# Altium schematic sheet Current Sensors.SchDoc
size A
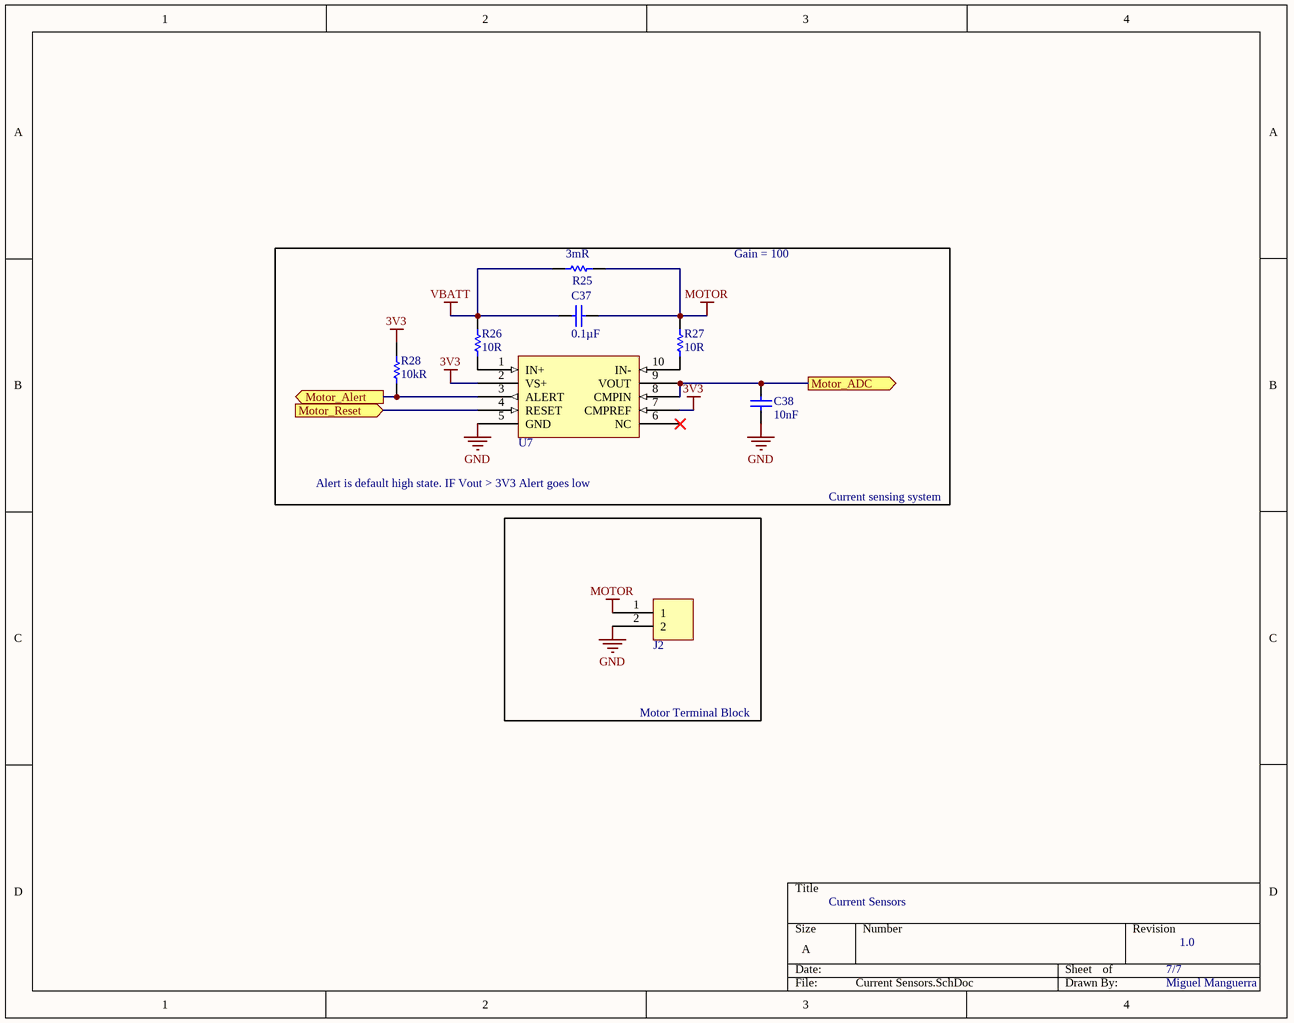
[diagram p0: Current Sensors.SchDoc]

## Parts
C37  Capacitance: 0.1µF  [CAPC1608N(0603")]  (hidden comment: 0.1uF, 50V, 10%, X7R, 0603)
C38  value 10nF  [CAPC1608N(0603")]  (hidden comment: 10 nF, 50V 0603 SMD, Ceramic)
J2  2x1 Terminal Block 3.5mm  [2x1 Terminal Block 3.5mm-Footprint-1]  (value not drawn)
R25  3mR, 1%, 1W, 1206  [RESC1632X07M]  (value not drawn)
R26  Resistance: 10R  [FP-ERJ3EK-IPC_A]  (hidden comment: ERJ3EKF10R0V)
R27  Resistance: 10R  [FP-ERJ3EK-IPC_A]  (hidden comment: ERJ3EKF10R0V)
R28  Resistance: 10kR  [RESC1608X55X25ML10T15]  (hidden comment: RC0603FR-0710KL)
U7  INA381A3IDGSR  [TSSOP50P490X110-10N]  (value not drawn)

## Blocks framed on the sheet
Motor Terminal Block: J2

## Ports
Motor_ADC (out), Motor_Alert (out), Motor_Reset (in)

## Nets
3V3: R28.2 U7.2(VS+) U7.7(CMPREF)
GND: C38.1(Anode) J2.2 U7.5(GND)
MOTOR: C37.1(Anode) J2.1 R25.2 R27.2
VBATT: C37.2(Cathode) R25.1 R26.2
Motor_ADC: C38.2(Cathode) U7.8(CMPIN) U7.9(VOUT) ; port Motor_ADC
Motor_Alert: R28.1 U7.3(ALERT) ; port Motor_Alert
Motor_Reset: U7.4(RESET) ; port Motor_Reset
NetR26_1: R26.1 U7.1(IN+)
NetR27_1: R27.1 U7.10(IN-)

Not connected (* = marked no-connect by the designer): U7 6(NC)*

## Notes on the sheet
- Gain = 100
- Alert is default high state. IF Vout > 3V3 Alert goes low
- Current sensing system
- Current Sensors
- 7/7
- 1.0
- Miguel Manguerra

## Library data of the parts
C37 = CMP-006-0007-1: 0.1µF ±10% Ceramic Capacitor X7R 0603 (1608 Metric); Operating Temperature: -55°C ~ 125°C; Pin Count: 2; Design Item ID: 0.1uF, 50V, 10%, X7R, 0603; Package / Case: 0603 (1608 Metric); Source: AUVic_Schematic_Library_Capacitors.SchLib; ComponentLink1URL: https://www.digikey.ca/product-detail/en/tdk-corporation/C1608X7R1H104M080AA/445-5098-1-ND/2093713; ComponentLink1Description: Digi-Key; Mounting Type: Surface Mount, MLCC; Component Type: Standard; Created By: Poorna Chander Kalidas
C38 = CMP-006-0010-1: Capacitor, Ceramic, 50V, +/- 10%, 0603 SMD; MFG: Samsung; MFG#: GRM188R61A475KE15D; Created By: Gabriel; Design Item ID: 10 nF, 50V 0603 SMD, Ceramic; PackageDescription: Chip Capacitor; Source: AUVic_Schematic_Library_Capacitors.SchLib; Published: 16-06-23; Pin Count: 2; Publisher: AUVic; Component Type: Standard
J2 = CMP-00117-2: P=3.5mm Screw terminal RoHS; Created by: Miguel Manguerra; LCSC Part #: C474892
R25 = CMP-00122-4: 3 mOhms ±1% 1W Chip Resistor Wide 1206 (3216 Metric), 0612; Resistance: 3mR
R26 R27 = CMP-00034-2: PANASONIC - ERJ3EKF10R0V - SMD Chip Resistor, 0603 [1608 Metric], 10 ohm, ERJ3EK Series, 75 V, Thick Film, 100 mW; Temperature Coefficient: 100ppm/°C; Tolerance: 1%; Max Power Dissipation: 100mW; Voltage Rating (DC): 75V; Package Quantity: 5000; Case Code (Imperial): 0603; Military Standard: Not; Depth: 0.8mm; Number of Terminations: 2; Working Voltage: 75V; Min Operating Temperature: -55°C; Width: 0.8mm; Composition: Thick Film; Packaging: Tape and Reel; Power Rating: 100mW; REACH SVHC: No SVHC; Max Operating Temperature: 155°C; Case Code (Metric): 1608; Features: Automotive AEC-Q200; Case/Package: 0603; Length: 1.6mm; Number of Pins: 2; Lead Free: Lead Free; Height: 0.45mm; Voltage Rating: 75V; Contact Plating: Tin; Termination: SMD/SMT; Mount: Surface Mount; Radiation Hardening: No
R28 = CMP-00037-1: Res General Purpose Thick Film 0603 10K Ohm 1% 1/10W ±100ppm/°C Molded SMD Paper T/R; Power Rating: 100mW; Voltage Rating (DC): 50V; Voltage Rating: 75V; Case/Package: 0603; Weight: 7.1E-05oz; Case Code (Imperial): 0603; Composition: Thick Film; Depth: 0.8mm; Min Operating Temperature: -55°C; Width: 0.8mm; Height: 0.45mm; Military Standard: Not; Packaging: Tape and Reel; Termination: SMD/SMT; Lead Free: Lead Free; Temperature Coefficient: 100ppm/°C; Number of Pins: 2; Max Operating Temperature: 155°C; Lead Pitch: 0.3mm; REACH SVHC: No SVHC; Case Code (Metric): 1608; Tolerance: 1%; Length: 1.6mm
U7 = CMP-00120-1: 26V, 350kHz current sense amplifier w/ integrated over-current comparator 10-VSSOP -40 to 125